# Altium schematic sheet Controleur_charge.SchDoc
size A4
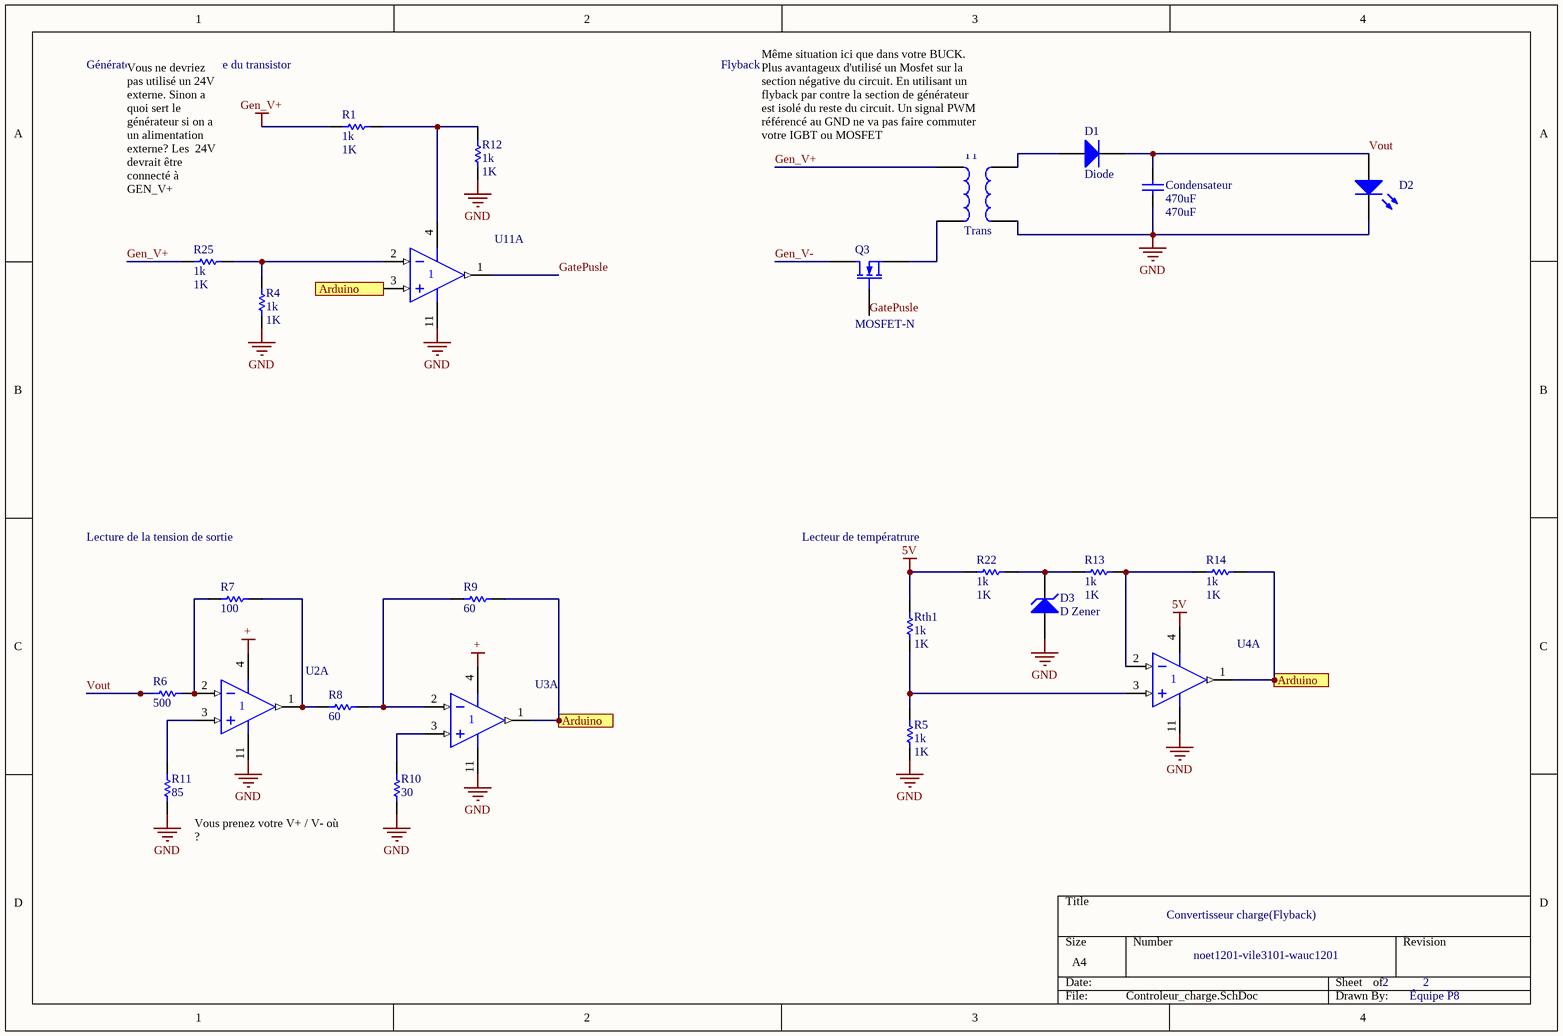
[diagram p0: Controleur_charge.SchDoc]

## Parts
Condensateur  470uF  [RAD-0.3]
D1  Diode  [SMC]
D2  (no value)  [LED-0]
D3  D Zener  [DIODE-0.7]
Q3  MOSFET-N  [E3]
R1  1k  [AXIAL-0.3]
R4  1k  [AXIAL-0.3]
R5  1k  [AXIAL-0.3]
R6  500  [AXIAL-0.3]
R7  100  [AXIAL-0.3]
R8  60  [AXIAL-0.3]
R9  60  [AXIAL-0.3]
R10  30  [AXIAL-0.3]
R11  85  [AXIAL-0.3]
R12  1k  [AXIAL-0.3]
R13  1k  [AXIAL-0.3]
R14  1k  [AXIAL-0.3]
R22  1k  [AXIAL-0.3]
R25  1k  [AXIAL-0.3]
Rth1  1k  [AXIAL-0.3]
T1  Trans  [TRANS]
U2  (no value)  [D014_N]  (part A of 4)
U3  (no value)  [D014_N]  (part A of 4)
U4  (no value)  [D014_N]  (part A of 4)
U11  (no value)  [D014_N]  (part A of 4)

## Ports
Arduino

## Nets
5V: R22.1 Rth1.2 U4.4(V+)
+: U2.4(V+) U3.4(V+)
Gen_V+: R1.1 R25.1 T1.1
GND: Condensateur.2 D2.2(K) D3.1(A) R4.1 R5.1 R10.1 R11.1 R12.1 T1.4 U2.11(V-) U3.11(V-) U4.11(V-) U11.11(V-)
Arduino: R9.2 R14.2 U3.1(OUT) U4.1(OUT) U11.3(IN+) ; port Arduino
GatePusle: Q3.2(G) U11.1(OUT)
Gen_V-: Q3.1(D)
Vout: Condensateur.1 D1.2(K) D2.1(A) R6.2
NetD1_1: D1.1(A) T1.3
NetD3_2: D3.2(K) R13.1 R22.2
NetQ3_3: Q3.3(S) T1.2
NetR1_2: R1.2 R12.2 U11.4(V+)
NetR4_2: R4.2 R25.2 U11.2(IN-)
NetR5_2: R5.2 Rth1.1 U4.3(IN+)
NetR6_1: R6.1 R7.1 U2.2(IN-)
NetR7_2: R7.2 R8.2 U2.1(OUT)
NetR8_1: R8.1 R9.1 U3.2(IN-)
NetR10_2: R10.2 U3.3(IN+)
NetR11_2: R11.2 U2.3(IN+)
NetR13_2: R13.2 R14.1 U4.2(IN-)

## Notes on the sheet
- Générateur du pusle à la gate du transistor
- Flyback
- (near T1) Même situation ici que dans votre BUCK. Plus avantageux d'utilisé un Mosfet sur la section négative du circuit. En utilisant un flyback par contre la section de générateur est isolé du reste du circuit. Un signal PWM référencé au GND ne va pas faire commuter votre IGBT ou MOSFET
- Vous ne devriez pas utilisé un 24V externe. Sinon a quoi sert le générateur si on a un alimentation externe? Les  24V devrait être connecté à GEN_V+
- Lecture de la tension de sortie
- Lecteur de températrure
- (near R11) Vous prenez votre V+ / V- où ?
- Convertisseur charge(Flyback)
- noet1201-vile3101-wauc1201
- 2
- Équipe P8

## Library data of the parts
Condensateur = Cap: Capacitor; Published: 8-Jun-2000; LatestRevisionDate: 17-Jul-2002; LatestRevisionNote: Re-released for DXP Platform.; PackageReference: RAD-0.3; Publisher: Altium Limited; PackageDescription: Radial Cap, Thru-Hole; 2 Leads; 0.3 in Pin Spacing; Value: 470uF
D1 = Diode: Default Diode; Published: 8-Jun-2000; LatestRevisionDate: 17-Jul-2002; LatestRevisionNote: Re-released for DXP Platform.; PackageVersion: Sep-1996; PackageReference: SMC; Publisher: Altium Limited; PackageDescription: DO-214-AB/SMC; 2 C-Bend Leads; Body 7.9 x 5.9 mm, inc. leads (LxW); Code_JEDEC: DO-214-AB
D2 = LED0: Typical INFRARED GaAs LED; Published: 8-Jun-2000; LatestRevisionDate: 08-Jul-2005; LatestRevisionNote: Mech Layer 1 removed.; PackageReference: LED-0; Publisher: Altium Limited; PackageDescription: LED; 2 Leads
D3 = D Zener: Zener Diode; Published: 8-Jun-2000; LatestRevisionDate: 17-Jul-2002; LatestRevisionNote: Re-released for DXP Platform.; PackageReference: DIODE-0.7; Publisher: Altium Limited; PackageDescription: Diode, Thru-Hole; 2 Leads; 0.7 in Pin Spacing
Q3 = MOSFET-N: N-Channel MOSFET; Published: 8-Jun-2000; LatestRevisionDate: 17-Jul-2002; LatestRevisionNote: Re-released for DXP Platform.; PackageVersion: 1995/1996; PackageReference: E3; Publisher: Altium Limited; PackageDescription: TO, Flat Index; 3 In-Line, Axial Leads; Body Dia. 4.6mm; Lead Dia. 0.5 mm (max)
R1 R4-R14 R22 R25 Rth1 = Res1: Resistor; Published: 8-Jun-2000; LatestRevisionDate: 17-Jul-2002; LatestRevisionNote: Re-released for DXP Platform.; PackageReference: AXIAL-0.3; Publisher: Altium Limited; PackageDescription: Axial Device, Thru-Hole; 2 Leads; 0.3 in Pin Spacing
  R1 R4 R5 R12-R14 R22 R25 Rth1: Value: 1K
T1 = Trans: Transformer; Published: 24-Mar-1999; LatestRevisionDate: 08-Jul-2005; LatestRevisionNote: Mech Layer 1 removed.; PackageReference: TRANS; Publisher: Altium Limited; PackageDescription: Transformer; 4 Leads
U2-U4 U11 = LM324AD: Quadruple Operational Amplifier; Published: 15-Apr-2002; LatestRevisionDate: 13-Apr-2006; LatestRevisionNote: IPC-7351 Footprint Added.; DatasheetVersion: Jan-1989; PackageVersion: Jan-1998; PackageReference: D014; Publisher: Altium Limited; PackageDescription: 14-Pin Small Outline Integrated Circuit 1.27 mm Pitch; Code_IPC: SOIC127P600-14; ComponentLink1Description: Manufacturer Link; ComponentLink1URL: http://www.ti.com/; ComponentLink2Description: Datasheet; ComponentLink2URL: http://www-s.ti.com/sc/ds/lm324.pdf